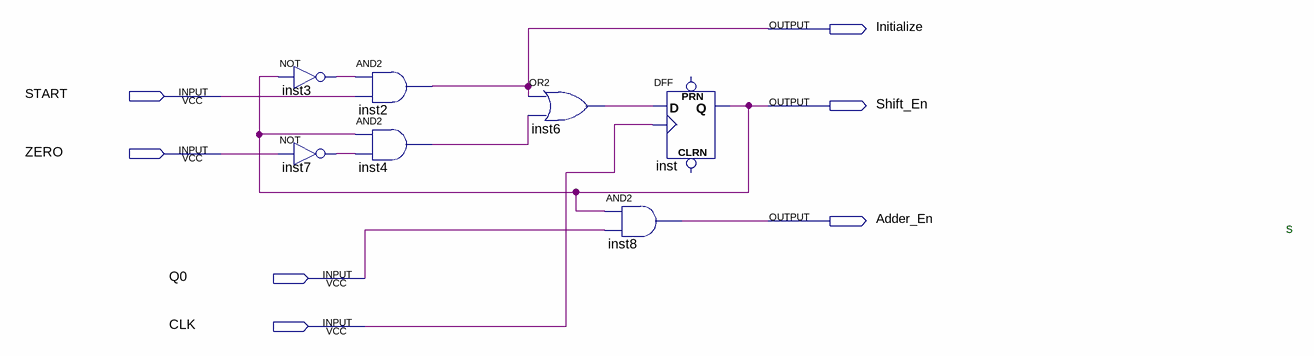
[diagram p0: schematic sheet]
// Quartus schematic control1.bdf as structural Verilog: 7 symbols, 7 pins
module control1 (
  input  START,
  input  ZERO,
  input  Q0,
  input  CLK,
  output Initialize,
  output Shift_En,
  output Adder_En
);

  wire inst3_out, inst4_out, inst6_out, inst7_out;

  not inst3 (inst3_out, Shift_En);
  not inst7 (inst7_out, ZERO);
  and inst2 (Initialize, inst3_out, START);
  and inst4 (inst4_out, Shift_En, inst7_out);
  or inst6 (inst6_out, Initialize, inst4_out);
  DFF inst (.CLK(CLK), .D(inst6_out), .Q(Shift_En));  // open: CLRN, PRN
  and inst8 (Adder_En, Shift_En, Q0);

  // Notes on the sheet:
  //   s
endmodule
